# EAGLE design esp_wifi_switch (EAGLE 8.4.2)
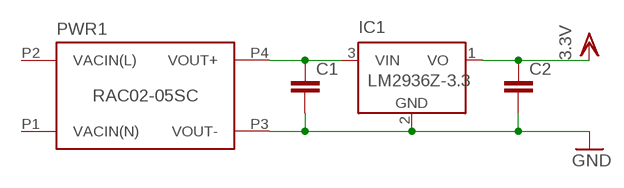
[diagram p0: schematic, sheet 1]

## Parts
C1  C-EU025-025X050  [C025-025X050]
C2  C-EU025-025X050  [C025-025X050]
IC1  LM2936Z-3.3  [TO92]
PWR1  RAC02-05SC  [LOW_PROFILE_POWER_MODULE]

## Nets
GND: C1.2 C2.2 IC1.2(GND) PWR1.P3(VOUT-)
N$1: C1.1 IC1.3(VIN) PWR1.P4(VOUT+)
VDD: C2.1 IC1.1(VO) ; supply symbol labelled 3.3V

## Power pins joined to a net without a drawn wire
VACIN(L): PWR1.P2(VACIN(L))
VACIN(N): PWR1.P1(VACIN(N))

## Library data of the parts
C1 C2 = rcl:C-EU: CAPACITOR, European symbol
IC1 = national-semiconductor:LM2936?*: Ultra-Low Quiescent Current LDO Voltage Regulator Source: Data sheet <http://www.national.com/ds/LM/LM2936.pdf>; MF: NATIONAL SEMICONDUCTOR; MPN: LM2936Z-3.3/NOPB; OC_FARNELL: 1564641; OC_NEWARK: 41K4532
PWR1 = recom-powerline-acdc-converters:RAC*SC: RECOM POWERLINE AC/DC-Converter (RAC01-SC and RAC02-SC series) The RAC01-SC and RAC02-SC series are ultra-compact universal input AC/DC power modules for PCB mounting. They feature high efficiency, low standby power, high operating temperature, soft start and short-circuit protection as well as a built-in EMC Class B filter. Output voltages range from 3.3VDC to 24VDC. Datasheet <http://www.recom-power.com/pdf/Powerline-AC-DC/RAC01_02-SC.pdf>; INPUT_RANGE: 80 - 277 (VAC); MAX_CAPACITIVE_LOAD: 1200uF; OUTPUT_CURRENT: 400mA; OUTPUT_VOLTAGE: 5v

## Board
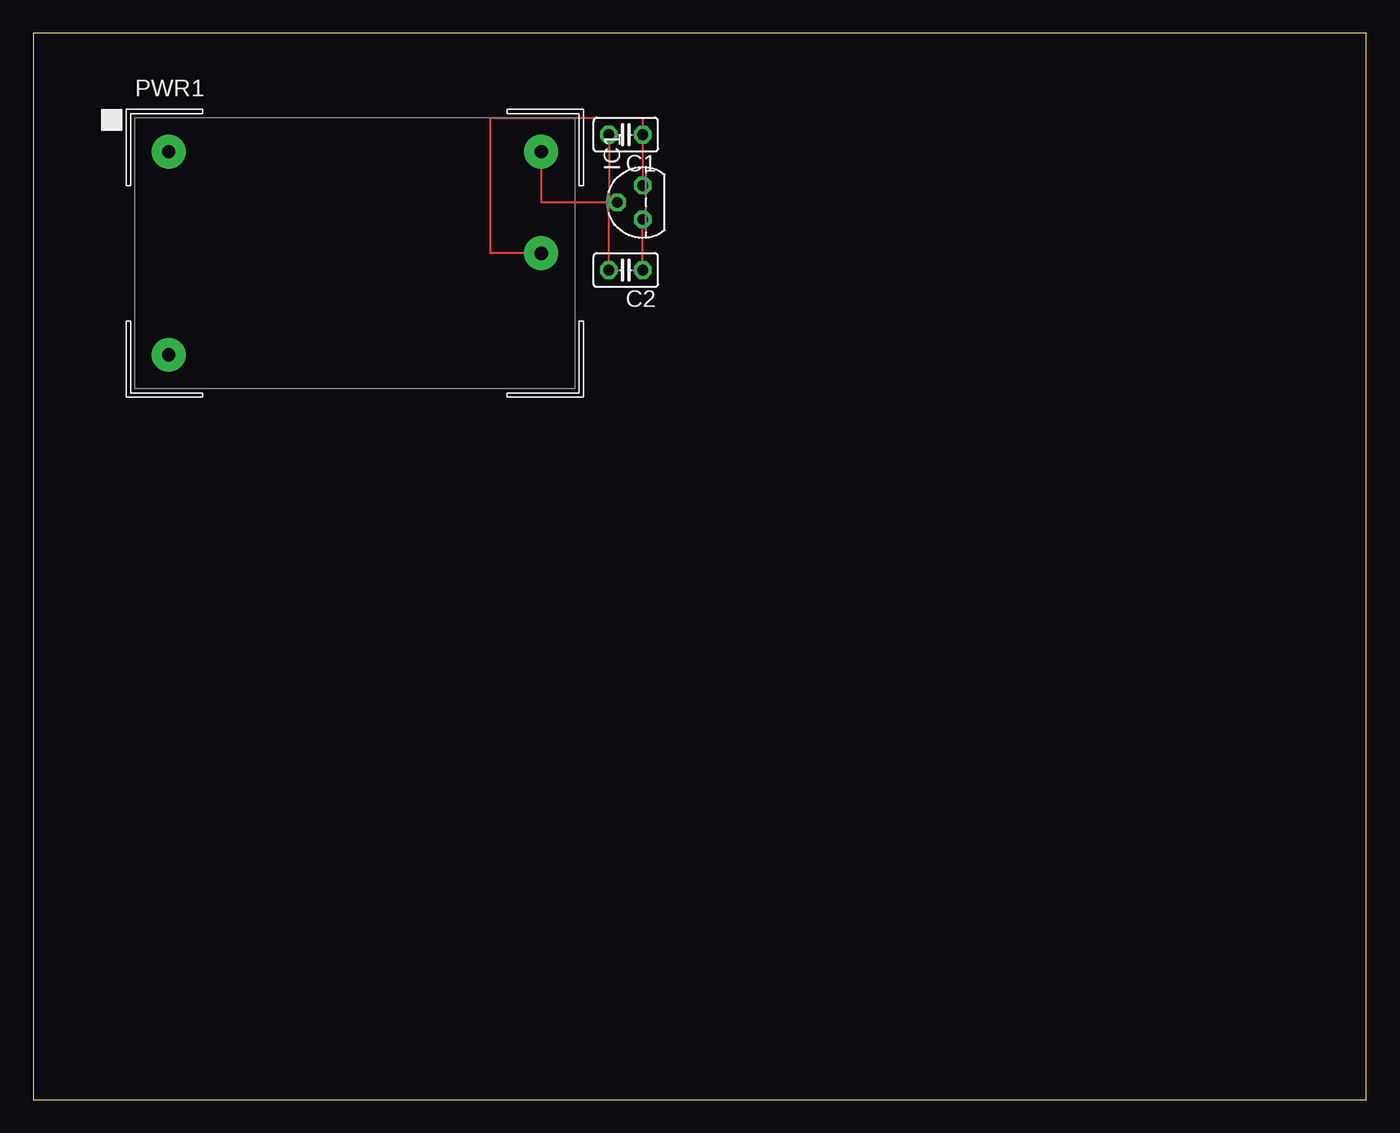
[diagram p1: board, top side]

Size 100 x 80 mm. Coordinates in mm from the lower left corner, seen from the top.
Outline: 0,0 100,0 100,80 0,80 0,0
Copper layers (1*16): Top 0.035mm / dielectric 1.5mm / Bottom 0.035mm
Design rules "default": minimum track width 6mil, minimum drill 0.35mm, track to track 6mil, track to pad 6mil, pad to pad 6mil, via to via 6mil, smd to smd 6mil, copper to edge 40mil, drill to drill 6mil, minimum pad ring 10mil, minimum via ring 8mil, stop-mask expansion 4mil, vias tented up to drill 0mil, thermal gap 10mil

### Footprints (pad centres in the part's own frame; a part is rotated, then mirrored left to right if it is on the bottom)
C025-025X050 = drill 0.813 octagon: 1 -1.27,0; 2 1.27,0
TO92 = drill 0.813 pad 1.27 octagon: 1 -1.27,0; 2 0,1.905; 3 1.27,0
LOW_PROFILE_POWER_MODULE = drill 1 pad 2.54: P1 -12.7,7.62; P2 -12.7,-7.62; P3 15.24,7.62; P4 15.24,0

### Placement (x,y rotation side)
C1  44.45,72.39 180 top
C2  44.45,62.23 180 top
IC1  45.72,67.31 90 top
PWR1  22.86,63.5 0 top

### Tracks (layer width: path | path; a pad name or v marks a point on that pad's centre or on a via)
GND
  Top 0.152: PWR1.P3 38.1,67.31 43.18,67.31 | 43.18,67.31 IC1.2 | C1.2 43.18,67.31 | C2.2 43.18,67.31
N$1
  Top 0.152: PWR1.P4 34.29,63.5 34.29,73.66 45.72,73.66 C1.1 IC1.3
VDD
  Top 0.152: C2.1 IC1.1